# EAGLE design CMoy-Pro-V_1_0_0_1a (EAGLE 6.4)
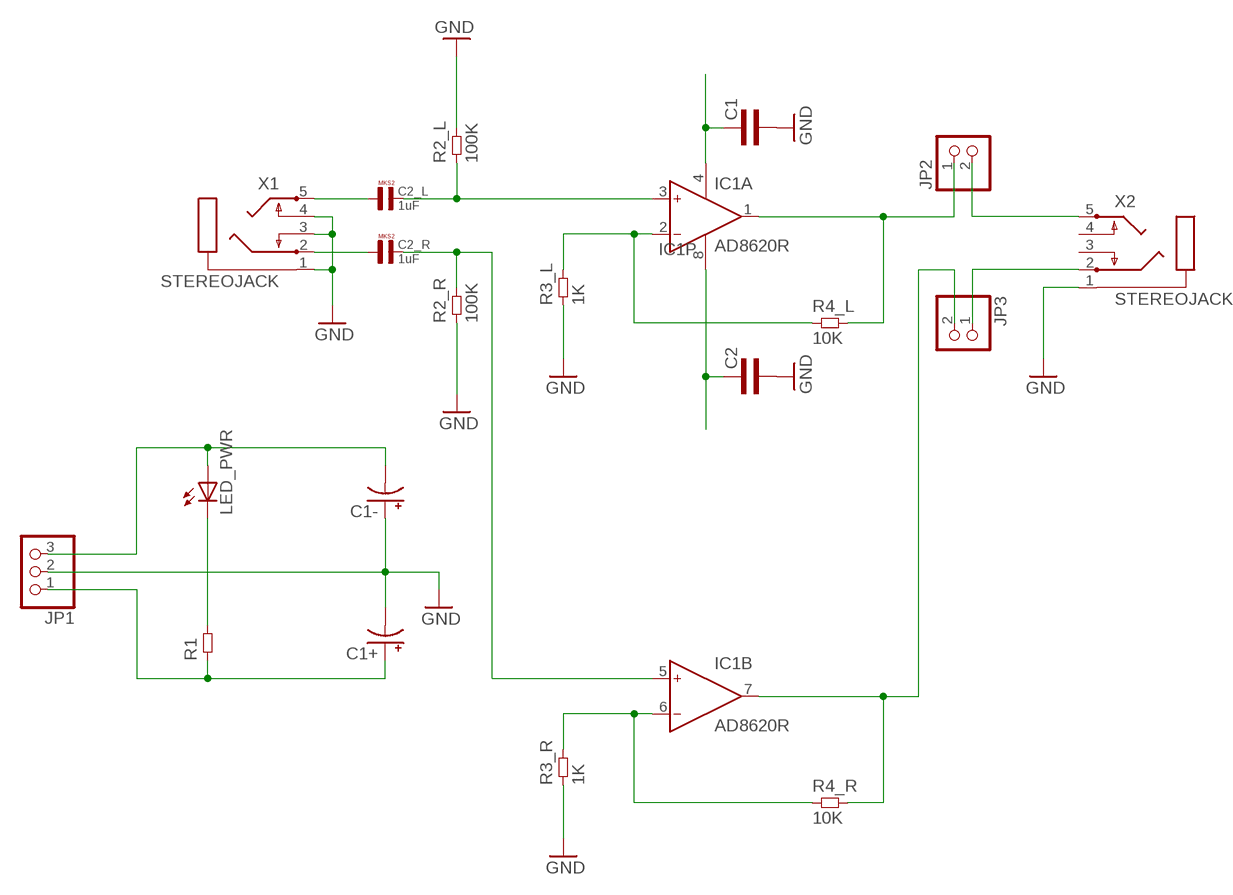
[diagram p0: schematic, sheet 1]

## Parts
C1  CAP0603L3  [0603L3]
C1+  CPOL-US140CLH-1010  [140CLH-1010]
C1-  CPOL-US140CLH-1010  [140CLH-1010]
C2  CAP0603L3  [0603L3]
C2_L  1uF  1,0µF  [R5B5]
C2_R  1uF  1,0µF  [R5B5]
IC1  AD8620R  [SO8]
JP1  PINHD-1X3  [1X03]
JP2  PINHD-1X2  [1X02]
JP3  PINHD-1X2  [1X02]
LED_PWR  LEDCHIP-LED0603  [CHIP-LED0603]
R1  RES0603L3  [0603L3]
R2_L  100K  RES0603L3  [0603L3]
R2_R  100K  RES0603L3  [0603L3]
R3_L  1K  RES0603L3  [0603L3]
R3_R  1K  RES0603L3  [0603L3]
R4_L  10K  RES0603L3  [0603L3]
R4_R  10K  RES0603L3  [0603L3]
X1  STEREOJACK  [STX3100]
X2  STEREOJACK  [STX3100]

## Nets
GND: C1+.- C1-.+ C1.P$2 C2.P$2 JP1.2 R2_L.P$2 R2_R.P$1 R3_L.P$1 R3_R.P$1 X1.1 X1.3 X1.4 X2.1
HP_L: C2_R.1 X1.2
HP_R: C2_L.1 X1.5
IN_L: C2_R.2 IC1.5(B:IN+) R2_R.P$2
IN_R: C2_L.2 IC1.3(A:IN+) R2_L.P$1
N$1: LED_PWR.C R1.P$2
N$2: JP2.2 X2.5
N$3: JP3.1 X2.2
N$5: IC1.2(A:IN-) R3_L.P$2 R4_L.P$1
N$6: IC1.6(B:IN-) R3_R.P$2 R4_R.P$1
OUT_L: IC1.1(A:OUT) JP2.1 R4_L.P$2
OUT_R: IC1.7(B:OUT) JP3.2 R4_R.P$2
V+: C1+.+ C2.P$1 IC1.8(P:V+) JP1.1 R1.P$1
V-: C1-.- C1.P$1 IC1.4(P:V-) JP1.3 LED_PWR.A
Unconnected: X2.3 X2.4

## Library data of the parts
C1 C2 = common:CAP
C1+ C1- = rcl:CPOL-US: POLARIZED CAPACITOR, American symbol
C2_L C2_R = Capacitor-Wima-MKS2-63v:1,0µF
IC1 = analog-devices:AD8620: Precision, Very Low Noise, Low Input Bias Current, Wide Bandwidth JFET Operational Amplifiers Source: http://www.analog.com/static/imported-files/data_sheets/AD8610_8620.pdf; MF: ALTERA CORPORATION; MPN: AD8620ARZ; OC_FARNELL: 9994386; OC_NEWARK: 59K6972
JP1 = pinhead:PINHD-1X3: PIN HEADER
JP2 JP3 = pinhead:PINHD-1X2: PIN HEADER
LED_PWR = adafruit:LED: LED OSRAM: - CHIPLED LG R971, LG N971, LY N971, LG Q971, LY Q971, LO R971, LY R971 LH N974, LH R974 LS Q976, LO Q976, LY Q976 LO Q996 - Hyper CHIPLED LW Q18S LB Q993, LB Q99A, LB R99A - SideLED LS A670, LO A670, LY A670, LG A670, LP A670 LB A673, LV A673, LT A673, LW A673 LH A674 LY A675 LS A676, LA A676, LO A676, LY A676, LW A676 LS A679, LY A679, LG A679 - Hyper Micro SIDELED® LS Y876, LA Y876, LO Y876, LY Y876 LT Y87S - SmartLED LW L88C, LW L88S LB L89C, LB L89S, LG L890 LS L89K, LO L89K, LY L89K LS L896, LA L896, LO L896, LY L896 - TOPLED LS T670, LO T670, LY T670, LG T670, LP T670 LSG T670, LSP T670, LSY T670, LOP T670, LYG T670 LG T671, LOG T671, LSG T671 LB T673, LV T673, LT T673, LW T673 LH T674 LS T676, LA T676, LO T676, LY T676, LB T676, LH T676, LSB T676, LW T676 LB T67C, LV T67C, LT T67C, LS T67K, LO T67K, LY T67K, LW E67C LS E67B, LA E67B, LO E67B, LY E67B, LB E67C, LV E67C, LT E67C LW T67C LS T679, LY T679, LG T679 LS T770, LO T770, LY T770, LG T770, LP T770 LB T773, LV T773, LT T773, LW T773 LH T774 LS E675, LA E675, LY E675, LS T675 LS T776, LA T776, LO T776, LY T776, LB T776 LHGB T686 LT T68C, LB T68C - Hyper Mini TOPLED® LB M676 - Mini TOPLED Santana® LG M470 LS M47K, LO M47K, LY M47K Source: http://www.osram.convergy.de/
R1 R2_L R2_R R3_L R3_R R4_L R4_R = common:RES
X1 X2 = adafruit:STEREOJACK: MIC/HEADPHONE JACK Stereo jack with two switches. Kycon STX3100, CUI SJ1-3555NG and/or 4UCon 05544

## Board
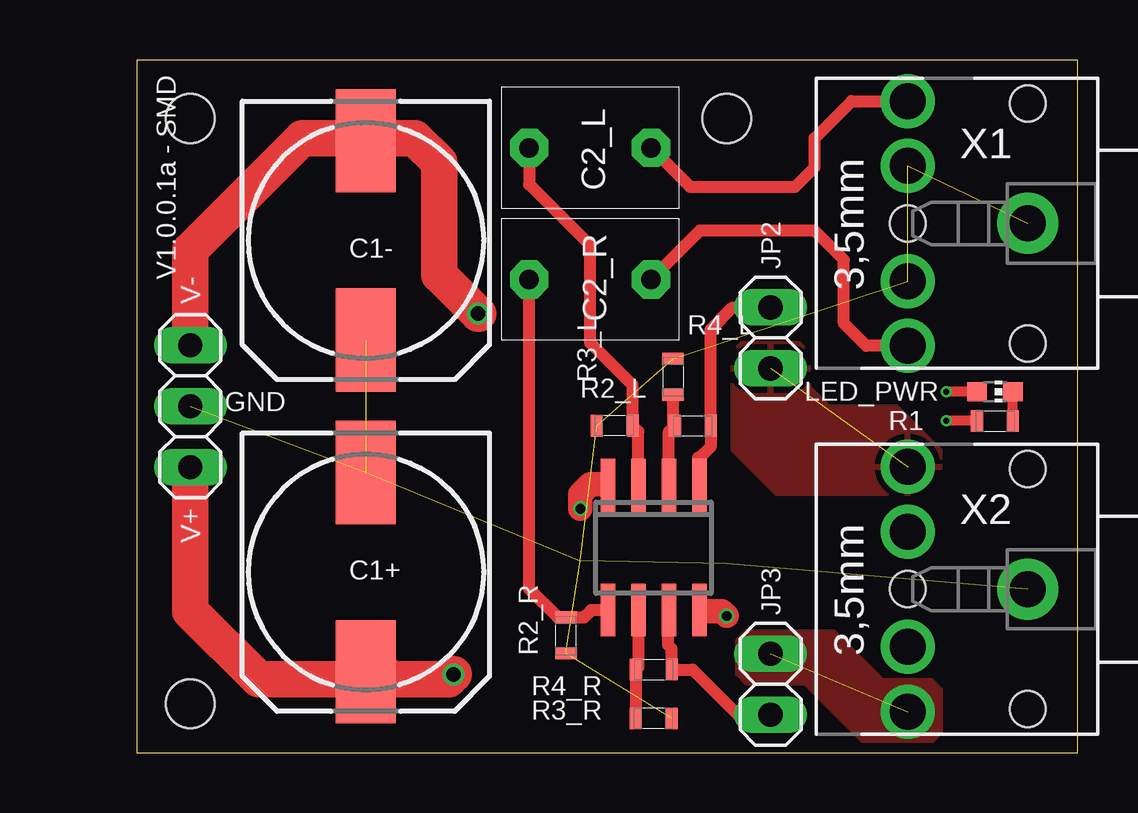
[diagram p1: board, top side]
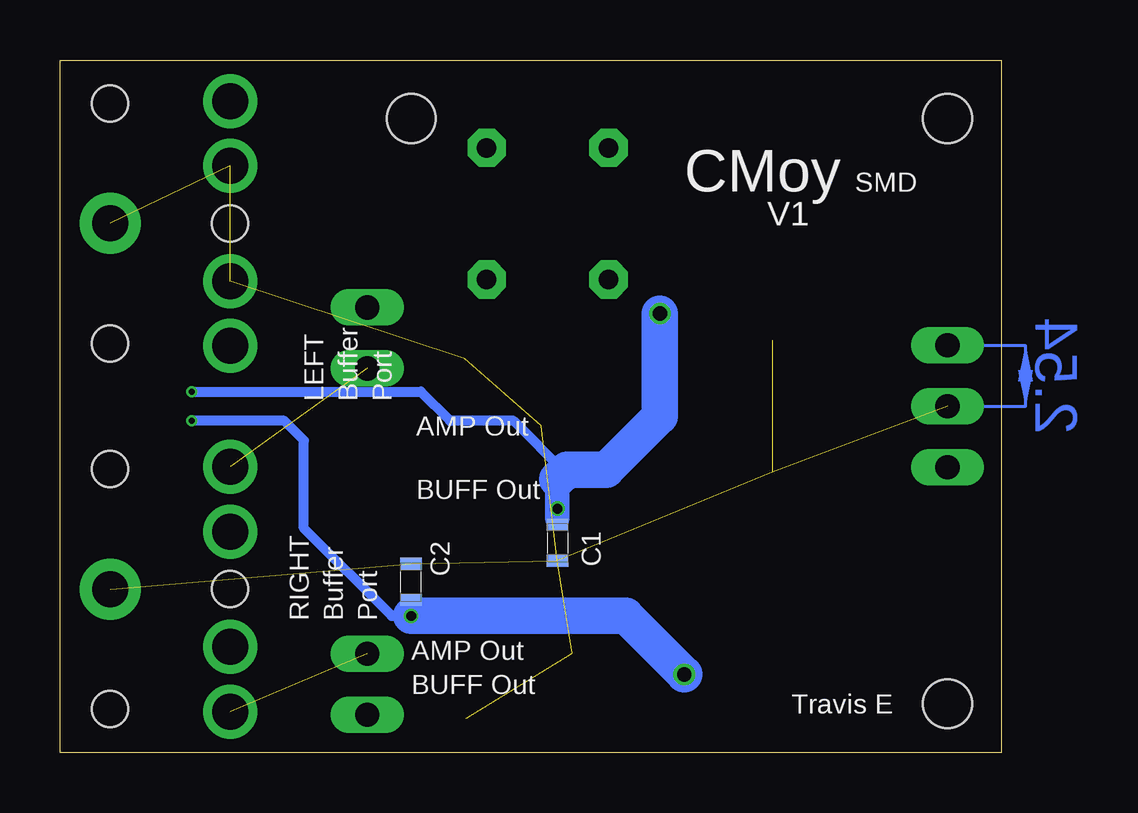
[diagram p2: board, bottom side, seen from below]

Size 39.22 x 28.85 mm. Coordinates in mm from the lower left corner, seen from the top.
Outline: 39.22,0 39.22,28.85 0,28.85 0,0 39.22,0
Copper layers (1*16): Top 0.035mm / dielectric 1.5mm / Bottom 0.035mm
Design rules "default *": minimum track width 6mil, minimum drill 10mil, track to track 6mil, track to pad 6mil, pad to pad 6mil, via to via 6mil, smd to smd 6mil, copper to edge 16mil, drill to drill 8mil, minimum pad ring 4mil, minimum via ring 4mil, stop-mask expansion 4mil, vias tented up to drill 24mil, thermal gap 10mil
Holes 2.03 mm at 2.24,26.42 24.59,26.42 2.24,2.03

### Footprints (pad centres in the part's own frame; a part is rotated, then mirrored left to right if it is on the bottom)
0603L3 = smd 0.5 x 0.9: P$1 -0.75,0; P$2 0.75,0
140CLH-1010 = smd 4.3 x 2.5: + 4.15,0; - -4.15,0
R5B5 = drill 0.813 pad 1.6 octagon: 1 -2.54,0; 2 2.54,0
SO8 = smd 0.6 x 2.2: 1 -1.905,-2.6; 2 -0.635,-2.6; 3 0.635,-2.6; 4 1.905,-2.6; 5 1.905,2.6; 6 0.635,2.6; 7 -0.635,2.6; 8 -1.905,2.6
1X03 = drill 1.016 long: 1 -2.54,0; 2 0,0; 3 2.54,0
1X02 = drill 1.016 long: 1 -1.27,0; 2 1.27,0
CHIP-LED0603 = smd 0.8 x 0.8: A 0,-0.75; C 0,0.75
STX3100 = drill 1.5 pad 2.54: 1 2.7,-0.1 | drill 1.5: 2 7.7,5; 3 7.7,2.3; 4 7.7,-2.5; 5 7.7,-5.2 | hole 1.5: 2.7,4.9; 2.7,-5.1; 7.7,-0.1

### Placement (x,y rotation side)
C1  18.49,8.74 270 bottom
C1+  9.55,7.52 270 top
C1-  9.55,21.34 270 top
C2  24.59,7.11 90 bottom
C2_L  18.9,25.2 180 top
C2_R  18.9,19.71 180 top
IC1  21.54,8.53 180 top
JP1  2.24,14.43 90 top
JP2  26.42,17.27 270 top
JP3  26.42,2.84 270 top
LED_PWR  35.76,15.04 270 top
R1  35.76,13.82 0 top
R2_L  19.91,13.61 180 top
R2_R  17.88,4.88 90 top
R3_L  22.35,15.65 270 top
R3_R  21.54,1.42 180 top
R4_L  23.16,13.61 0 top
R4_R  21.54,3.45 0 top
X1  39.83,21.95 180 top
X2  39.83,6.71 180 top

### Tracks (layer width: path | path; a pad name or v marks a point on that pad's centre or on a via)
GND  (12 unrouted)
HP_L
  Top 0.508: X1.2 30.4,16.95 29.46,17.88 29.46,20.52 28.25,21.74 23.47,21.74 C2_R.1
HP_R
  Top 0.508: C2_L.1 23.06,23.57 27.43,23.57 28.25,24.38 28.25,25.6 29.79,27.15 X1.5
IN_L
  Top 0.279: IC1.5 19.55,5.93
  Top 0.508: IC1.5 18.94,5.93 18.63,5.63 R2_R.P$2 17.54,5.63 16.36,6.81 C2_R.2
IN_R
  Top 0.508: IC1.3 20.9,13.37 R2_L.P$1 20.66,15.3 18.9,17.07 18.9,21.13 16.36,23.67 C2_L.2
N$1
  Top 0.406: R1.P$2 LED_PWR.C
N$2  (1 unrouted)
  pour Top: 25.2,17.07 24.79,16.66 24.79,12.6 26.62,10.77 32.92,10.77 33.53,11.38 33.53,12.4 33.53,12.6 32.92,13.21 31.7,14.43 31.29,14.43 28.85,14.43 28.24,15.04 28.04,15.24 28.04,16.66 27.64,17.07
N$3  (1 unrouted)
  pour Top (no thermals): 25.4,5.08 29.06,5.08 31.09,3.05 33.12,3.05 33.53,2.64 33.53,0.81 33.12,0.41 30.28,0.41 27.84,2.84 25.4,2.84 24.99,3.25 24.99,4.67
N$5
  Top 0.508: IC1.2 22.17,13.37 R4_L.P$1 22.35,13.68 R3_L.P$2
N$6
  Top 0.508: IC1.6 20.9,3.57 R4_R.P$1 R3_R.P$2
OUT_L
  Top 0.508: 23.44,12.27 23.91,12.74 R4_L.P$2 23.91,17.62 24.84,18.54 JP2.1
  Top 0.61: 23.44,12.27 IC1.1
OUT_R
  Top 0.508: IC1.7 22.15,5.91 22.15,4.47 22.29,4.33 R4_R.P$2 23.16,3.45 25.04,1.57 JP3.2
V+  (via drill 0.25, 0.41, 0.6)
  Top 0.254: IC1.8 23.73,5.93 23.77,5.89
  Top 0.406: R1.P$1 v33.73,13.82
  Top 1.016: 23.77,5.89 24.38,5.89 v24.59,5.69
  Top 1.524: v13.21,3.25 13.01,3.05 10.57,3.05 10.36,3.25 10.16,3.25 10.04,3.37 C1+.+ 9.23,3.05 5.08,3.05 2.23,5.89 JP1.1
  Bottom 0.254: 24.59,6.1 C2.P$1
  Bottom 0.406: v24.59,5.69 25.4,5.69 29.06,9.35 29.06,13.01 29.87,13.82 v33.73,13.82
  Bottom 1.016: v24.59,5.69 24.59,6.1
  Bottom 1.524: v13.21,3.25 15.65,5.69 v24.59,5.69
V-  (via drill 0.25, 0.41, 0.6)
  Top 0.279: IC1.4 19.35,11.13 19.3,11.18
  Top 0.406: LED_PWR.A v33.73,15.04
  Top 1.016: 19.3,11.18 18.9,11.18 18.49,10.77 v18.49,10.16
  Top 1.524: v14.22,18.29 12.6,19.91 12.6,24.59 11.58,25.6 9.67,25.6 C1-.- 9.43,25.6 6.91,25.6 2.23,20.93 JP1.3
  Bottom 0.254: 18.49,9.75 C1.P$1
  Bottom 0.406: v33.73,15.04 24.18,15.04 22.96,13.82 20.32,13.82 18.19,11.68
  Bottom 1.016: 18.49,11.38 v18.49,10.16 18.49,9.75
  Bottom 1.524: 18.49,11.38 18.19,11.68 18.09,11.79 16.46,11.79 14.22,14.02 v14.22,18.29
(copper drawn outside any net)
  shapes: Bottom area x1, Top area x1

### Text on the board
tPlace: V1.0.0.1a - SMD | V- | GND | V+
bPlace: SMD | CMoy | V1 | Port | Buffer | LEFT | AMP Out | BUFF Out | Port | Buffer | RIGHT | AMP Out | Travis E | BUFF Out